# EasyEDA schematic SCH_RT1064_2024-05-07.json

## Sheets
1 Sheet_1_V2: TITLE: Sheet_1; REV: 1.0; Date: 2024-04-10; Sheet: 1/1; Drawn By: garfield1314; Company: Your Company
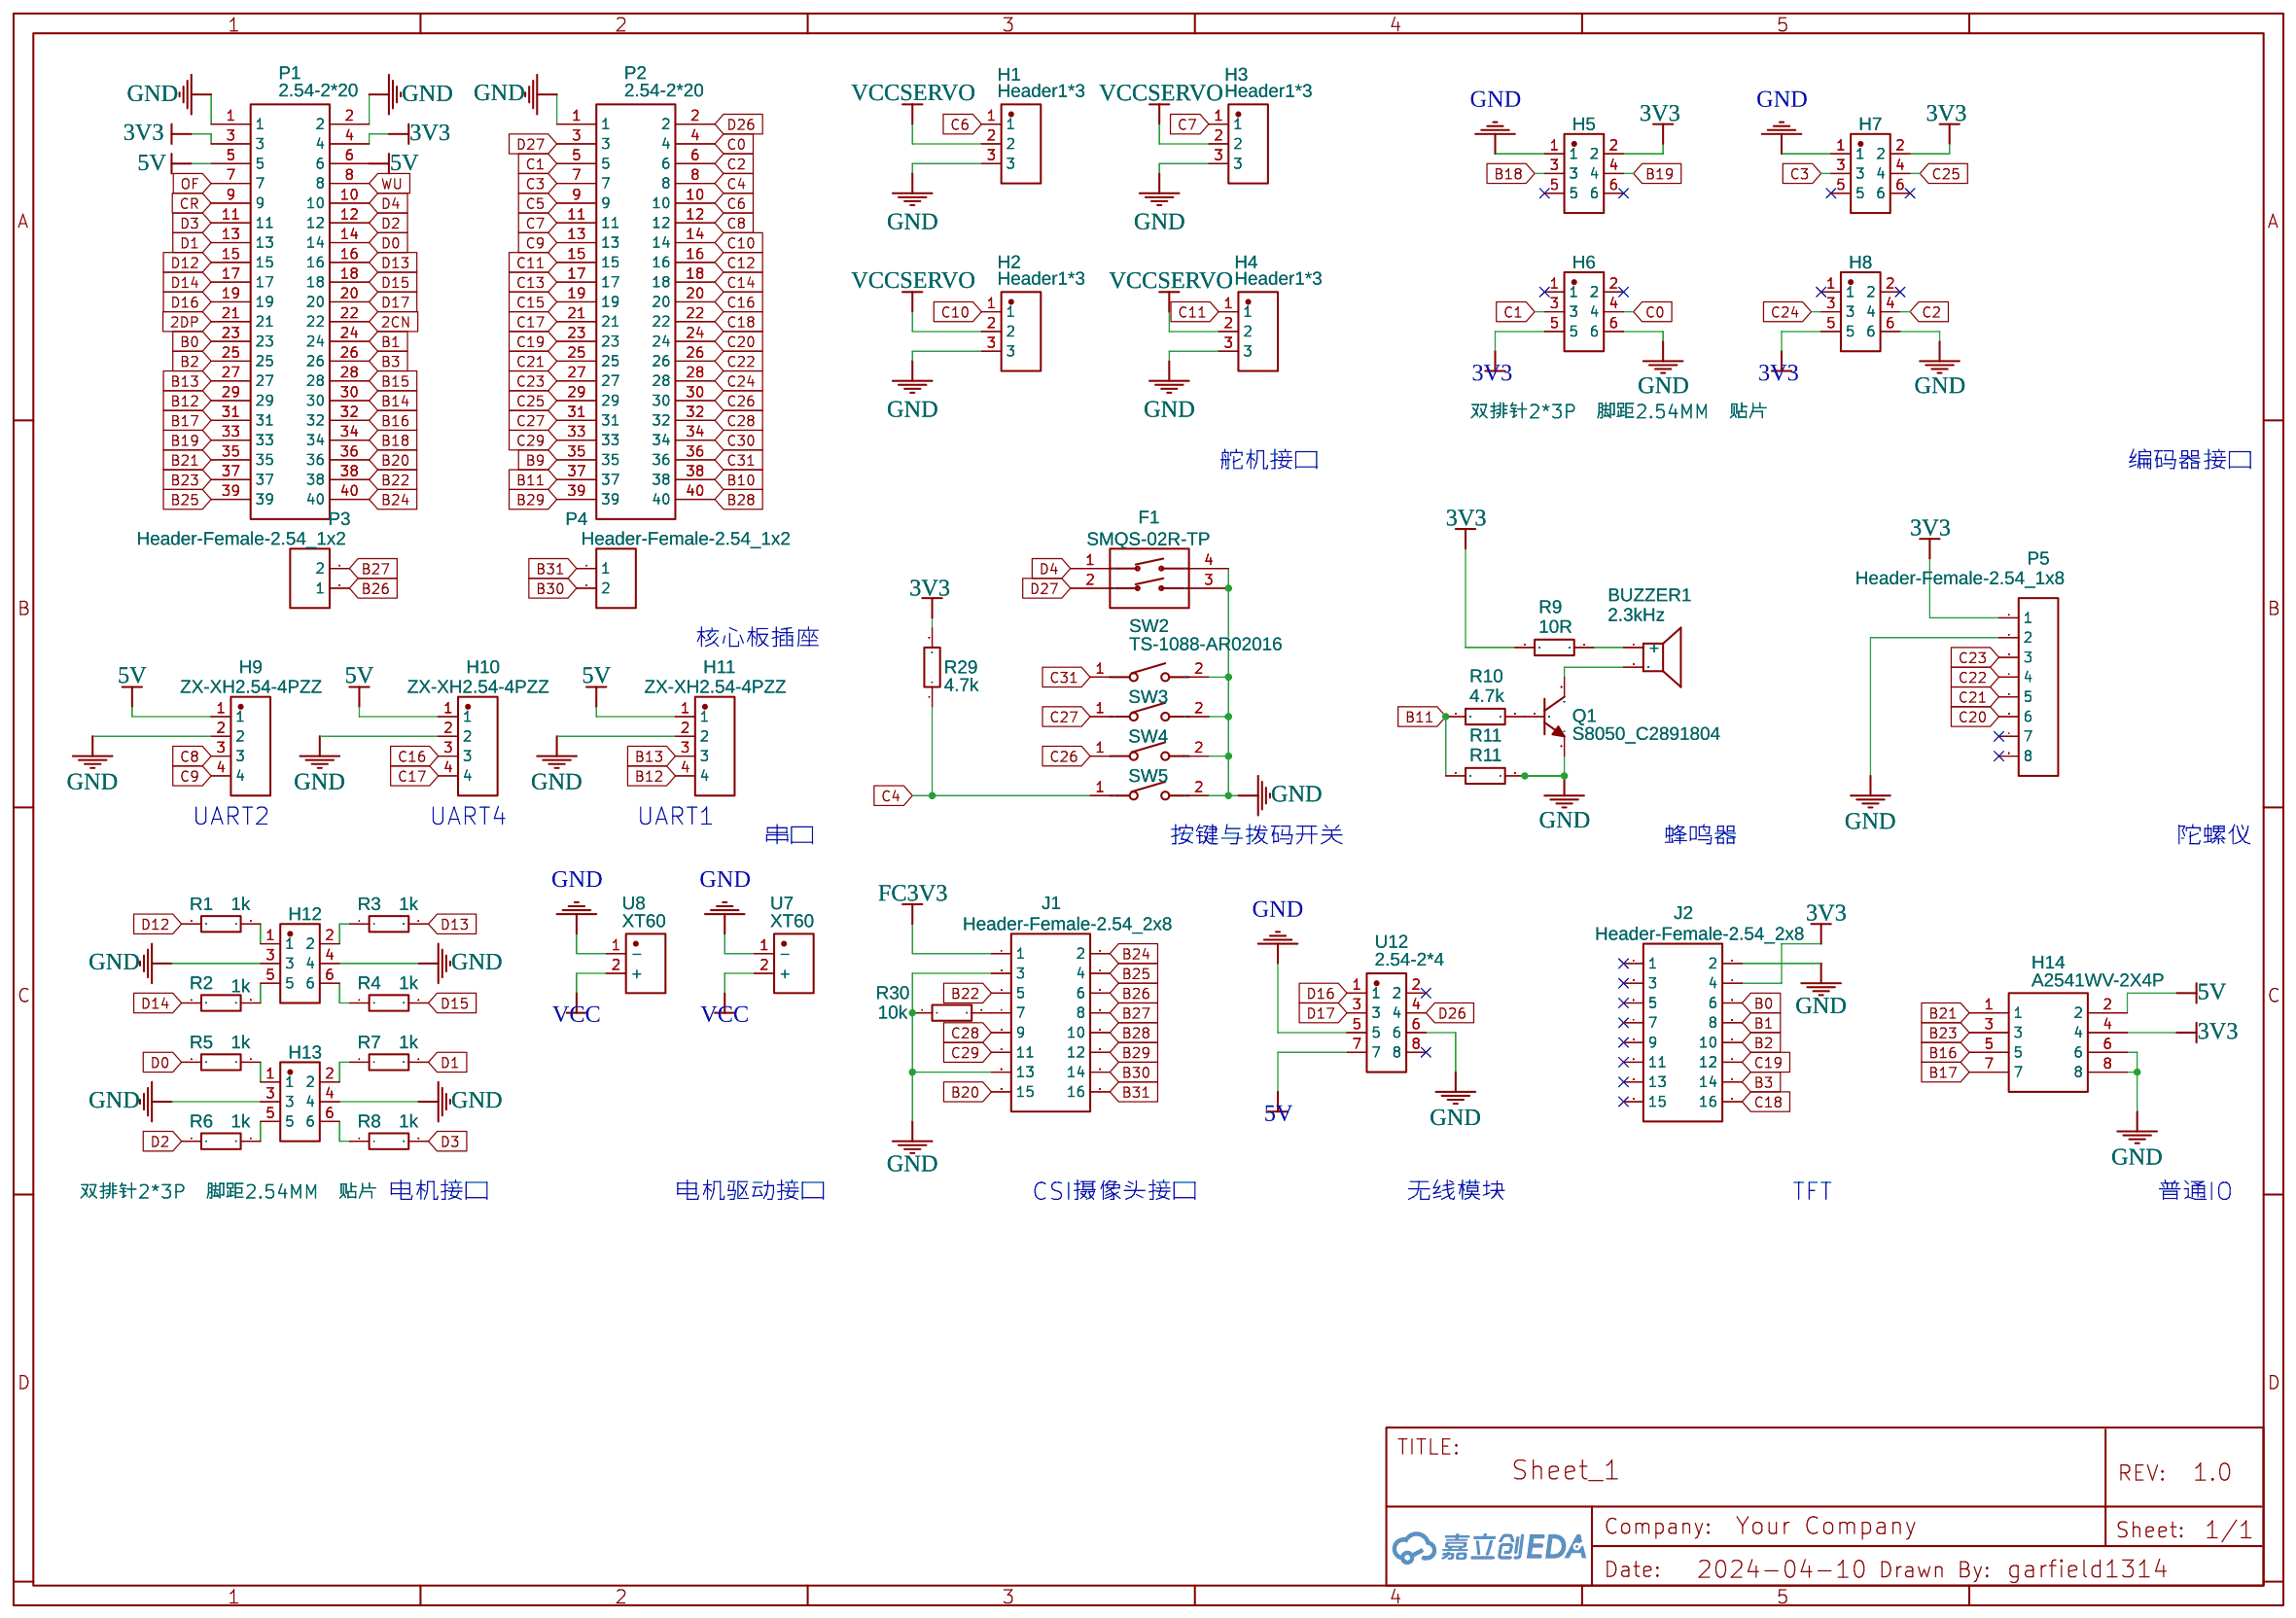
[diagram p0: Sheet_1_V2]
2 Sheet_2_V2: TITLE: Sheet_2
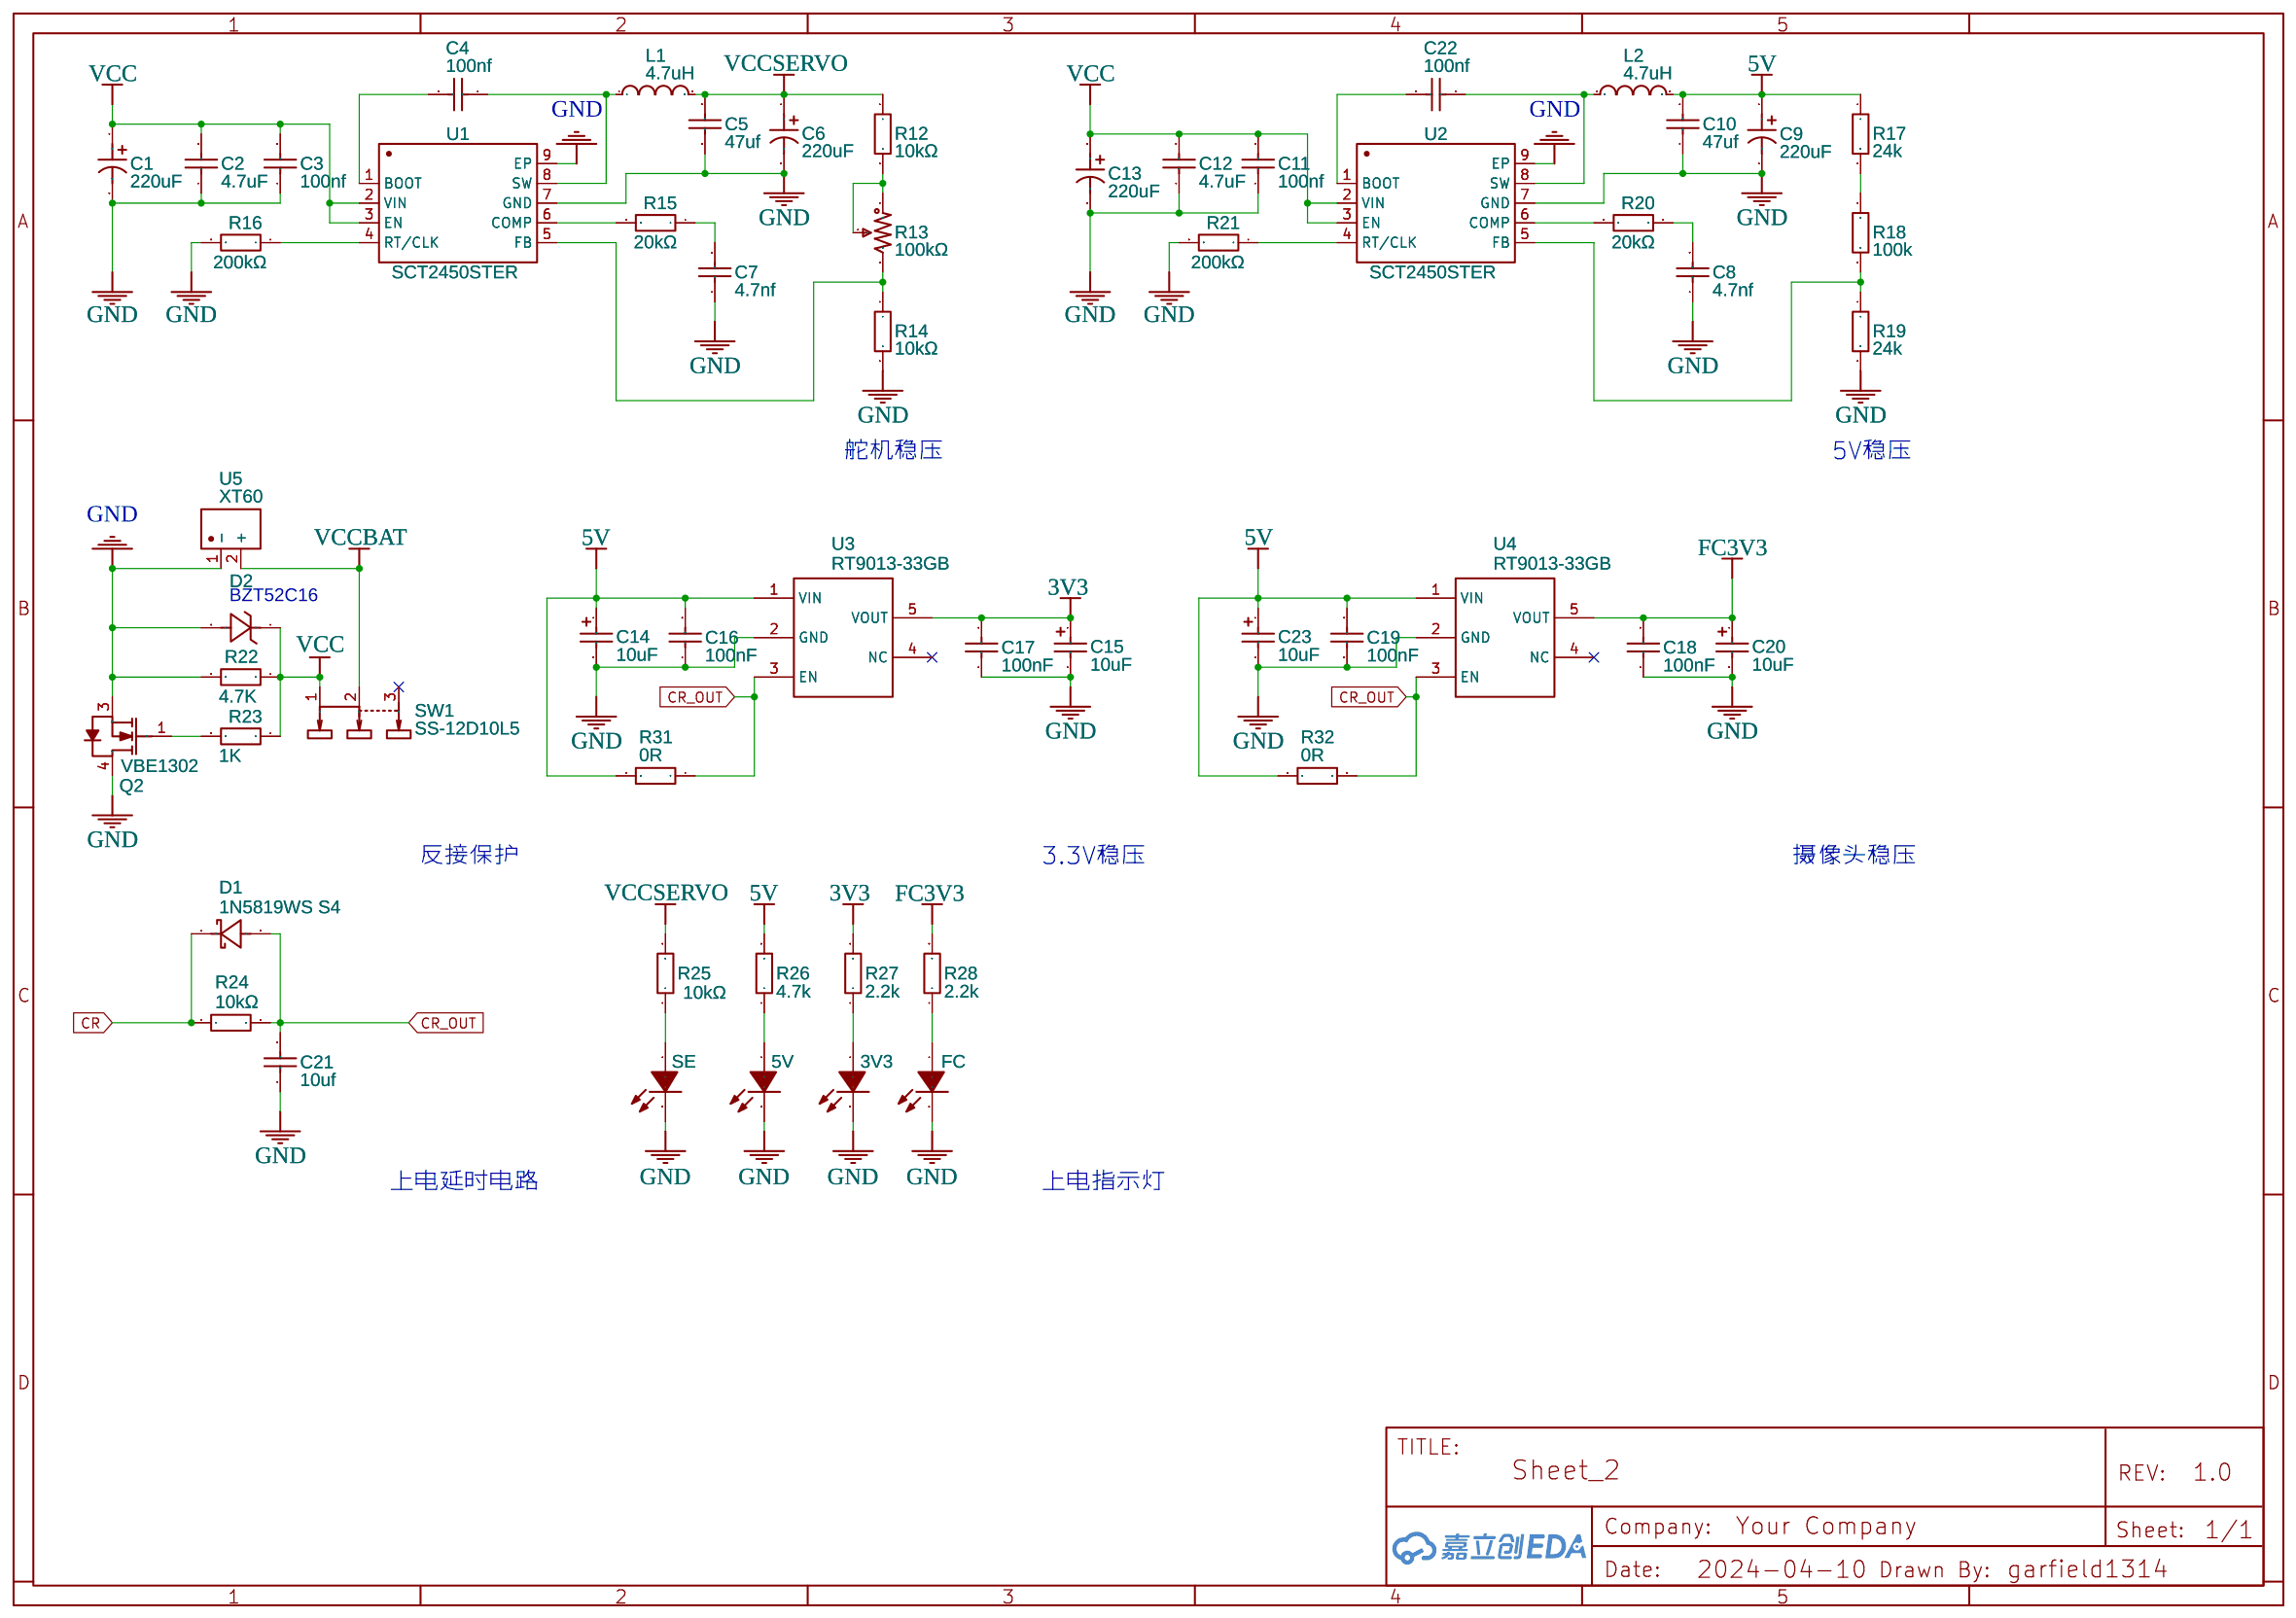
[diagram p1: Sheet_2_V2]

## Parts
sheet Sheet_1_V2
BUZZER1  2.3kHz  [BUZ-TH_BD12.0-P7.60-D0.6-FD]
F1  SMQS-02R-TP  [SW-TH_4P-L9.9-W6.8-P7.62-BL]
H1  Header1*3  [HDR-TH_3P-P2.54-V-M]
H2  Header1*3  [HDR-TH_3P-P2.54-V-M]
H3  Header1*3  [HDR-TH_3P-P2.54-V-M]
H4  Header1*3  [HDR-TH_3P-P2.54-V-M]
H5  双排针2*3P  脚距2.54MM  贴片  [HDR-SMD_6P-P2.54-V-M-R2-C3-S2.54-LS7.4]
H6  双排针2*3P  脚距2.54MM  贴片  [HDR-SMD_6P-P2.54-V-M-R2-C3-S2.54-LS7.4]
H7  双排针2*3P  脚距2.54MM  贴片  [HDR-SMD_6P-P2.54-V-M-R2-C3-S2.54-LS7.4]
H8  双排针2*3P  脚距2.54MM  贴片  [HDR-SMD_6P-P2.54-V-M-R2-C3-S2.54-LS7.4]
H9  ZX-XH2.54-4PZZ  [CONN-TH_4P-P2.50_4PIN]
H10  ZX-XH2.54-4PZZ  [CONN-TH_4P-P2.50_4PIN]
H11  ZX-XH2.54-4PZZ  [CONN-TH_4P-P2.50_4PIN]
H12  双排针2*3P  脚距2.54MM  贴片  [HDR-SMD_6P-P2.54-V-M-R2-C3-S2.54-LS7.4]
H13  双排针2*3P  脚距2.54MM  贴片  [HDR-SMD_6P-P2.54-V-M-R2-C3-S2.54-LS7.4]
H14  A2541WV-2X4P  [HDR-TH_8P-P2.54-V-R2-C4-S2.54_A2541WV-2X4P]
J1  Header-Female-2.54_2x8  [HDR-TH_16P-P2.54-V-F-R2-C8-S2.54]
J2  Header-Female-2.54_2x8  [HDR-TH_16P-P2.54-V-F-R2-C8-S2.54]
P1  2.54-2*20  [HDR-TH_40P-P2.54-V-F-R2-C20-S2.54]
P2  2.54-2*20  [HDR-TH_40P-P2.54-V-F-R2-C20-S2.54]
P3  Header-Female-2.54_1x2  [HDR-TH_2P-P2.54-V-F]
P4  Header-Female-2.54_1x2  [HDR-TH_2P-P2.54-V-F]
P5  Header-Female-2.54_1x8  [HDR-TH_8P-P2.54-V-F-1]
Q1  S8050_C2891804  [SOT-23-3_L2.9-W1.3-P1.90-LS2.4-BR]
R1  1k  [R0805]
R2  1k  [R0805]
R3  1k  [R0805]
R4  1k  [R0805]
R5  1k  [R0805]
R6  1k  [R0805]
R7  1k  [R0805]
R8  1k  [R0805]
R9  10R  [R0805]
R10  4.7k  [R0805]
R11  R11  [R0805]
R29  4.7k  [R0805]
R30  10k  [R0805]
SW2  TS-1088-AR02016  [SW-SMD_L3.9-W3.0-P4.45]
SW3  TS-1088-AR02016  [SW-SMD_L3.9-W3.0-P4.45]
SW4  TS-1088-AR02016  [SW-SMD_L3.9-W3.0-P4.45]
SW5  TS-1088-AR02016  [SW-SMD_L3.9-W3.0-P4.45]
U7  XT60  [CONN-TH_XT60]
U8  XT60  [CONN-TH_XT60]
U12  2.54-2*4  [HDR-TH_8P-P2.54-V-F-R2-C4-S2.54]
sheet Sheet_2_V2
3V3  FC-2012HRK-620D  [LED0805-R-RD]
5V  FC-2012HRK-620D  [LED0805-R-RD]
C1  220uF  [CAP-SMD_BD6.3-L6.6-W6.6-LS7.6-FD-1]
C2  4.7uF  [C0805]
C3  100nf  [C0805]
C4  100nf  [C0805]
C5  47uf  [C0805]
C6  220uF  [CAP-SMD_BD6.3-L6.6-W6.6-LS7.6-FD-1]
C7  4.7nf  [C0805]
C8  4.7nf  [C0805]
C9  220uF  [CAP-SMD_BD6.3-L6.6-W6.6-LS7.6-FD-1]
C10  47uf  [C0805]
C11  100nf  [C0805]
C12  4.7uF  [C0805]
C13  220uF  [CAP-SMD_BD6.3-L6.6-W6.6-LS7.6-FD-1]
C14  10uF  [CAP-SMD_L3.2-W1.6-RD-C7171]
C15  10uF  [CAP-SMD_L3.2-W1.6-RD-C7171]
C16  100nF  [C0805]
C17  100nF  [C0805]
C18  100nF  [C0805]
C19  100nF  [C0805]
C20  10uF  [CAP-SMD_L3.2-W1.6-RD-C7171]
C21  10uf  [C0805]
C22  100nf  [C0805]
C23  10uF  [CAP-SMD_L3.2-W1.6-RD-C7171]
D1  1N5819WS S4  [SOD-323_L1.6-W1.3-LS2.7-RD]
D2  D2  [SOD-123_L2.7-W1.7-LS3.8-RD]
FC  FC-2012HRK-620D  [LED0805-R-RD]
L1  4.7uH  [IND-SMD_L5.4-W5.2]
L2  4.7uH  [IND-SMD_L5.4-W5.2]
Q2  VBE1302  [TO-252-2_L6.6-W6.1-P4.58-LS9.9-TL-1]
R12  10kΩ  [R0805]
R13  100kΩ  [RES-ADJ-TH_3P-L10.0-W10.0-P2.50-L]
R14  10kΩ  [R0805]
R15  20kΩ  [R0805]
R16  200kΩ  [R0805]
R17  24k  [R0805]
R18  100k  [R0805]
R19  24k  [R0805]
R20  20kΩ  [R0805]
R21  200kΩ  [R0805]
R22  4.7K  [R0805]
R23  1K  [R0805]
R24  10kΩ  [R0805]
R25  10kΩ  [R0805]
R26  4.7k  [R0805]
R27  2.2k  [R0805]
R28  2.2k  [R0805]
R31  0R  [R0805]
R32  0R  [R0805]
SE  FC-2012HRK-620D  [LED0805-R-RD]
SW1  SS-12D10L5  [SW-TH_SS-12D10L5]
U1  SCT2450STER  [ESOP-8_L4.9-W3.9-P1.27-LS6.0-BL-EP]
U2  SCT2450STER  [ESOP-8_L4.9-W3.9-P1.27-LS6.0-BL-EP]
U3  RT9013-33GB  [SOT-23-5_L3.0-W1.7-P0.95-LS2.8-BL]
U4  RT9013-33GB  [SOT-23-5_L3.0-W1.7-P0.95-LS2.8-BL]
U5  XT60  [CONN-TH_XT60]

## Library data of the parts
BUZZER1 = TMB12A05: Supplier: LCSC; Manufacturer: 华能; Supplier Part: C96093; JLCPCB Part Class: Extended Part
F1 = SMQS-02R-TP: Supplier: LCSC; Supplier Part: C5299503; Manufacturer: SM Switch; Contributor: lcsc
H1-H4 = PZ254V-11-03P_C2937625: Contributor: LCSC; Supplier: LCSC; Supplier Part: C2937625; Manufacturer: XFCN(兴飞); Manufacturer Part: PZ254V-11-03P; JLCPCB Part Class: Extended Part
H5-H8 H12 H13 = 双排针2*3P  脚距2.54MM  贴片: Contributor: LCSC; Supplier: LCSC; Supplier Part: C77761; Manufacturer: BOOMELE(博穆精密); Manufacturer Part: 双排针2*3P 脚距2.54mm 贴片; JLCPCB Part Class: Extended Part
H9-H11 = ZX-XH2.54-4PZZ: Contributor: lcsc; Supplier: LCSC; Supplier Part: C7429634; Manufacturer: Megastar(兆星); JLCPCB Part Class: Extended Part; link: https://so.szlcsc.com/global.html?k=C7429634&ref=editor
H14 = A2541WV-2X4P: Contributor: LCSC; Supplier: LCSC; Supplier Part: C225519; Manufacturer: CJT(长江连接器); Manufacturer Part: A2541WV-2x4P; JLCPCB Part Class: Extended Part
J1 J2 = Header-Female-2.54_2x8: Supplier: LCSC; Manufacturer: BOOMELE(博穆精密); Manufacturer Part: 2.54-2*8P母; Supplier Part: C30734; JLCPCB Part Class: Extended Part
P1 P2 = 2.54-2*20: Contributor: LCSC; Supplier: LCSC; Supplier Part: C2977589; Manufacturer: ZHOURI(洲日); JLCPCB Part Class: Extended Part
P3 P4 = Header-Female-2.54_1x2: Supplier: LCSC; Manufacturer: BOOMELE(博穆精密); Manufacturer Part: 2.54-1*2P母; Supplier Part: C49661; JLCPCB Part Class: Extended Part
P5 = Header-Female-2.54_1x8: Supplier: LCSC; Manufacturer: BOOMELE(博穆精密); Manufacturer Part: 2.54-1*8P母环保; Supplier Part: C27438; JLCPCB Part Class: Extended Part
Q1 = S8050_C2891804: Contributor: LCSC; Supplier: LCSC; Supplier Part: C2891804; Manufacturer: YONGYUTAI(永裕泰); Manufacturer Part: S8050; JLCPCB Part Class: Extended Part
R1-R12 R14-R32 = 0805W8F2003T5E: Supplier: LCSC; Manufacturer: UNI-ROYAL(厚声); Supplier Part: C17539; JLCPCB Part Class: Basic Part
SW2-SW5 = TS-1088-AR02016: Contributor: LCSC; Supplier: LCSC; Supplier Part: C720477; Manufacturer: XUNPU(讯普); JLCPCB Part Class: Extended Part
U5 U7 U8 = XT60: Contributor: lcsc; Supplier: LCSC; Supplier Part: C98733; Manufacturer: AMASS(艾迈斯); JLCPCB Part Class: Extended Part
U12 = 2.54-2*4: Contributor: LCSC; Supplier: LCSC; Supplier Part: C2977588; Manufacturer: ZHOURI(洲日); JLCPCB Part Class: Extended Part
3V3 5V FC SE = FC-2012HRK-620D: Supplier: LCSC; Manufacturer: 国星光电; Manufacturer Part: NCD0805R1; Supplier Part: C84256; JLCPCB Part Class: Basic Part
C1 C6 C9 C13 = RVE100UF35V67RV0072: Contributor: LCSC; Supplier: LCSC; Supplier Part: C2836437; Manufacturer: KNSCHA(科尼盛)
C2-C5 C7 C8 C10-C12 C16-C19 C21 C22 = CL21A475KAQNNNE: Supplier: LCSC; Manufacturer: SAMSUNG(三星); Supplier Part: C1779; JLCPCB Part Class: Basic Part
C14 C15 C20 C23 = TAJA106K016RNJ: Supplier: LCSC; Manufacturer: Kyocera AVX; Supplier Part: C7171; JLCPCB Part Class: Basic Part
D1 = 1N5819WS S4: Contributor: LCSC; Supplier: LCSC; Supplier Part: C2927280; Manufacturer: JSMSEMI(杰盛微); JLCPCB Part Class: Extended Part
D2 = BZT52C16_C727007: Contributor: LCSC; Supplier: LCSC; Supplier Part: C727007; Manufacturer: TWGMC(台湾迪嘉); Manufacturer Part: BZT52C16; JLCPCB Part Class: Extended Part
L1 L2 = SLO0530H4R7MTT: Contributor: LCSC; Supplier: LCSC; Supplier Part: C325964; Manufacturer: Sunltech(韩国顺磁); JLCPCB Part Class: Extended Part
Q2 = VBE1302: Contributor: LCSC; Supplier: LCSC; Supplier Part: C480950; Manufacturer: VBsemi(微碧半导体); JLCPCB Part Class: Extended Part
R13 = 3296W-1-103: Resistance(Ohms): 10K; Contributor: LCSC; Supplier: LCSC; Supplier Part: C118954; Manufacturer: BOCHEN(博晨); JLCPCB Part Class: Extended Part
SW1 = SS-12D10L5: Contributor: LCSC; Supplier: LCSC; Supplier Part: C319012; Manufacturer: XKB Connectivity(中国星坤); JLCPCB Part Class: Extended Part
U1 U2 = SCT2450STER: Contributor: LCSC; Supplier: LCSC; Supplier Part: C509400; Manufacturer: SCT(芯洲科技); JLCPCB Part Class: Extended Part
U3 U4 = RT9013-33GB: Supplier: LCSC; Manufacturer: RICHTEK(立锜); Supplier Part: C47773; JLCPCB Part Class: Extended Part

## Nets
3V3: C15.1 C17.2 H5.2 H6.5 H7.2 H8.5 H14.4 J2.4 P1.3 P1.4 P5.1 R9.1 R27.2 R29.2 U3.5(VOUT)
5V: C9.1 C10.2 C14.1 C16.2 C19.2 C23.1 H9.1 H10.1 H11.1 H14.2 L2.2 P1.5 P1.6 R17.1 R26.2 R31.2 R32.2 U3.1(VIN) U4.1(VIN) U12.7
GND: 3V3.2(-) 5V.2(-) C1.2 C2.1 C3.1 C5.1 C6.2 C7.1 C8.1 C9.2 C10.1 C11.1 C12.1 C13.2 C14.2 C15.2 C16.1 C17.1 C18.1 C19.1 C20.2 C21.1 C23.2 D2.2(A) F1.3 F1.4 FC.2(-) H1.3 H2.3 H3.3 H4.3 H5.1 H6.6 H7.1 H8.6 H9.2 H10.2 H11.2 H12.3 H12.4 H13.3 H13.4 H14.6 H14.8 J1.3 J1.13 J2.2 P1.1 P1.2 P2.1 P5.2 Q1.2(E) Q2.3(S) Q2.4(D) R11.2 R14.2 R16.2 R19.2 R21.2 R22.2 R30.1 SE.2(-) SW2.2 SW3.2 SW4.2 SW5.2 U1.7(GND) U1.9(EP) U2.7(GND) U2.9(EP) U3.2(GND) U4.2(GND) U5.1(-) U7.1(-) U8.1(-) U12.5 U12.6
VCC: C1.1 C2.2 C3.2 C11.2 C12.2 C13.1 D2.1(K) R22.1 R23.1 SW1.1 U1.2(VIN) U1.3(EN) U2.2(VIN) U2.3(EN) U7.2(+) U8.2(+)
VCCBAT: SW1.2 U5.2(+)
VCCSERVO: C5.2 C6.1 H1.2 H2.2 H3.2 H4.2 L1.2 R12.1 R25.2
2CN: P1.22
2DP: P1.21
B0: J2.6 P1.23
B1: J2.8 P1.24
B2: J2.10 P1.25
B3: J2.14 P1.26
B9: P2.35
B10: P2.38
B11: P2.37 R10.1 R11.1
B12: H11.4 P1.29
B13: H11.3 P1.27
B14: P1.30
B15: P1.28
B16: H14.5 P1.32
B17: H14.7 P1.31
B18: H5.3 P1.34
B19: H5.4 P1.33
B20: J1.15 P1.36
B21: H14.1 P1.35
B22: J1.5 P1.38
B23: H14.3 P1.37
B24: J1.2 P1.40
B25: J1.4 P1.39
B26: J1.6 P3.1
B27: J1.8 P3.2
B28: J1.10 P2.40
B29: J1.12 P2.39
B30: J1.14 P4.2
B31: J1.16 P4.1
C0: H6.4 P2.4
C1: H6.3 P2.5
C2: H8.4 P2.6
C3: H7.3 P2.7
C4: P2.8 R29.1 SW5.1
C5: P2.9
C6: H1.1 P2.10
C7: H3.1 P2.11
C8: H9.3 P2.12
C9: H9.4 P2.13
C10: H2.1 P2.14
C11: H4.1 P2.15
C12: P2.16
C13: P2.17
C14: P2.18
C15: P2.19
C16: H10.3 P2.20
C17: H10.4 P2.21
C18: J2.16 P2.22
C19: J2.12 P2.23
C20: P2.24 P5.6
C21: P2.25 P5.5
C22: P2.26 P5.4
C23: P2.27 P5.3
C24: H8.3 P2.28
C25: H7.4 P2.29
C26: P2.30 SW4.1
C27: P2.31 SW3.1
C28: J1.9 P2.32
C29: J1.11 P2.33
C30: P2.34
C31: P2.36 SW2.1
CR: D1.1(C) P1.9 R24.1
CR_OUT: C21.2 D1.2(A) R24.2 R31.1 R32.1 U3.3(EN) U4.3(EN)
D0: P1.14 R5.1
D1: P1.13 R7.2
D2: P1.12 R6.1
D3: P1.11 R8.2
D4: F1.1 P1.10
D12: P1.15 R1.1
D13: P1.16 R3.2
D14: P1.17 R2.1
D15: P1.18 R4.2
D16: P1.19 U12.1
D17: P1.20 U12.3
D26: P2.2 U12.4
D27: F1.2 P2.3
FC3V3: C18.2 C20.1 J1.1 R28.2 U4.5(VOUT)
OF: P1.7
WU: P1.8
Net-(3V3-1): 3V3.1(+) R27.1
Net-(5V-1): 5V.1(+) R26.1
Net-(BUZZER1-1): BUZZER1.1(+) R9.2
Net-(BUZZER1-2): BUZZER1.2 Q1.3(C)
Net-(C4-1): C4.1 L1.1 U1.8(SW)
Net-(C4-2): C4.2 U1.1(BOOT)
Net-(C7-2): C7.2 R15.1
Net-(C8-2): C8.2 R20.1
Net-(C22-1): C22.1 L2.1 U2.8(SW)
Net-(C22-2): C22.2 U2.1(BOOT)
Net-(FC-1): FC.1(+) R28.1
Net-(H12-1): H12.1 R1.2
Net-(H12-2): H12.2 R3.1
Net-(H12-5): H12.5 R2.2
Net-(H12-6): H12.6 R4.1
Net-(H13-1): H13.1 R5.2
Net-(H13-2): H13.2 R7.1
Net-(H13-5): H13.5 R6.2
Net-(H13-6): H13.6 R8.1
Net-(J1-7): J1.7 R30.2
Net-(Q1-1): Q1.1(B) R10.2
Net-(Q2-1): Q2.1(G) R23.2
Net-(R12-2): R12.2 R13.1 R13.2
Net-(R13-3): R13.3 R14.1 U1.5(FB)
Net-(R15-2): R15.2 U1.6(COMP)
Net-(R16-1): R16.1 U1.4(RT/CLK)
Net-(R17-2): R17.2 R18.1
Net-(R18-2): R18.2 R19.1 U2.5(FB)
Net-(R20-2): R20.2 U2.6(COMP)
Net-(R21-1): R21.1 U2.4(RT/CLK)
Net-(R25-1): R25.1 SE.1(+)

Not connected (* = marked no-connect by the designer): H5 5* 6*; H6 1* 2*; H7 5* 6*; H8 1* 2*; J2 1* 3* 5* 7* 9* 11* 13* 15*; P5 7* 8*; SW1 3*; U3 4(NC)*; U4 4(NC)*; U12 2* 8*

## Notes on the sheets
sheet 1
- 舵机接口
- 编码器接口
- 核心板插座
- UART2
- UART4
- UART1
- 串口
- 按键与拨码开关
- 蜂鸣器
- 陀螺仪
- 电机接口
- 电机驱动接口
- CSI摄像头接口
- 无线模块
- TFT
- 普通IO
sheet 2
- 舵机稳压
- 5V稳压
- BZT52C16
- 反接保护
- 3.3V稳压
- 摄像头稳压
- 上电延时电路
- 上电指示灯
